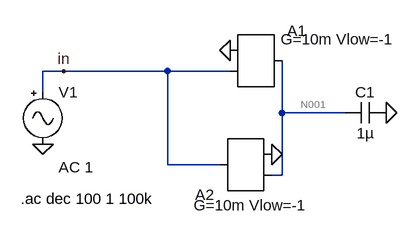
[diagram p0: schematic TP1-OTA.asc]
TP1-OTA.asc, the LTspice schematic file:
Version 4
SHEET 1 880 680
WIRE -96 192 -128 192
WIRE 64 192 -96 192
WIRE 160 192 64 192
WIRE -128 224 -128 192
WIRE 240 256 240 176
WIRE 336 256 240 256
WIRE 64 336 64 192
WIRE 144 336 64 336
WIRE 240 352 240 256
WIRE 240 352 224 352
FLAG 400 256 0
FLAG -128 304 0
FLAG -96 192 in
FLAG 160 160 0
FLAG 224 320 0
SYMBOL SpecialFunctions\\ota 192 400 R180
WINDOW 3 -87 2 Left 2
SYMATTR InstName A2
SYMATTR Value G=10m Vlow=-1
SYMBOL cap 336 272 R270
WINDOW 0 32 32 VTop 2
WINDOW 3 0 32 VBottom 2
SYMATTR InstName C1
SYMATTR Value 1µ
SYMBOL Misc\\signal -128 208 R0
WINDOW 123 24 132 Left 2
WINDOW 39 0 0 Left 0
SYMATTR InstName V1
SYMATTR Value ""
SYMATTR Value2 AC 1
SYMBOL SpecialFunctions\\ota 192 112 R0
WINDOW 3 46 31 Left 2
SYMATTR InstName A1
SYMATTR Value G=10m Vlow=-1
TEXT -162 388 Left 2 !.ac dec 100 1 100k

The netlist it stands for:
* TP1-OTA.asc
A2 N001 0 0 0 0 0 in 0 OTA G=10m Vlow=-1
C1 N001 0 1µ
V1 in 0 AC 1
A1 0 in 0 0 0 0 N001 0 OTA G=10m Vlow=-1
.ac dec 100 1 100k
.backanno
.end

* Results of the author's LTspice run, read from the files saved beside the schematic
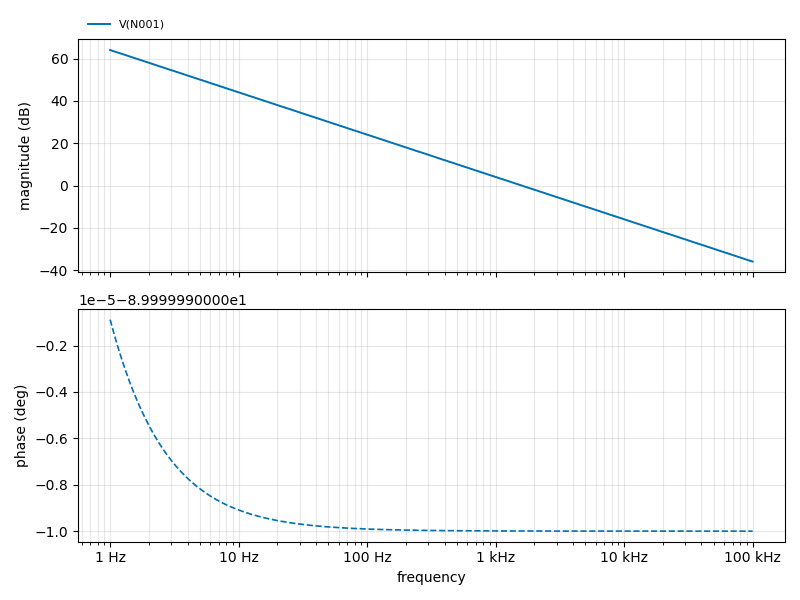
[diagram p1: AC Analysis of TP1-OTA.asc, plotted from the saved traces]
* AC Analysis, 1 run:
*   V(N001): 64.04 dB at 1 Hz, -35.96 dB at 100 kHz, peak 64.04 dB at 1 Hz, 3 dB below the peak at 1.414 Hz